# Altium project Audio_receiver.PrjPCB
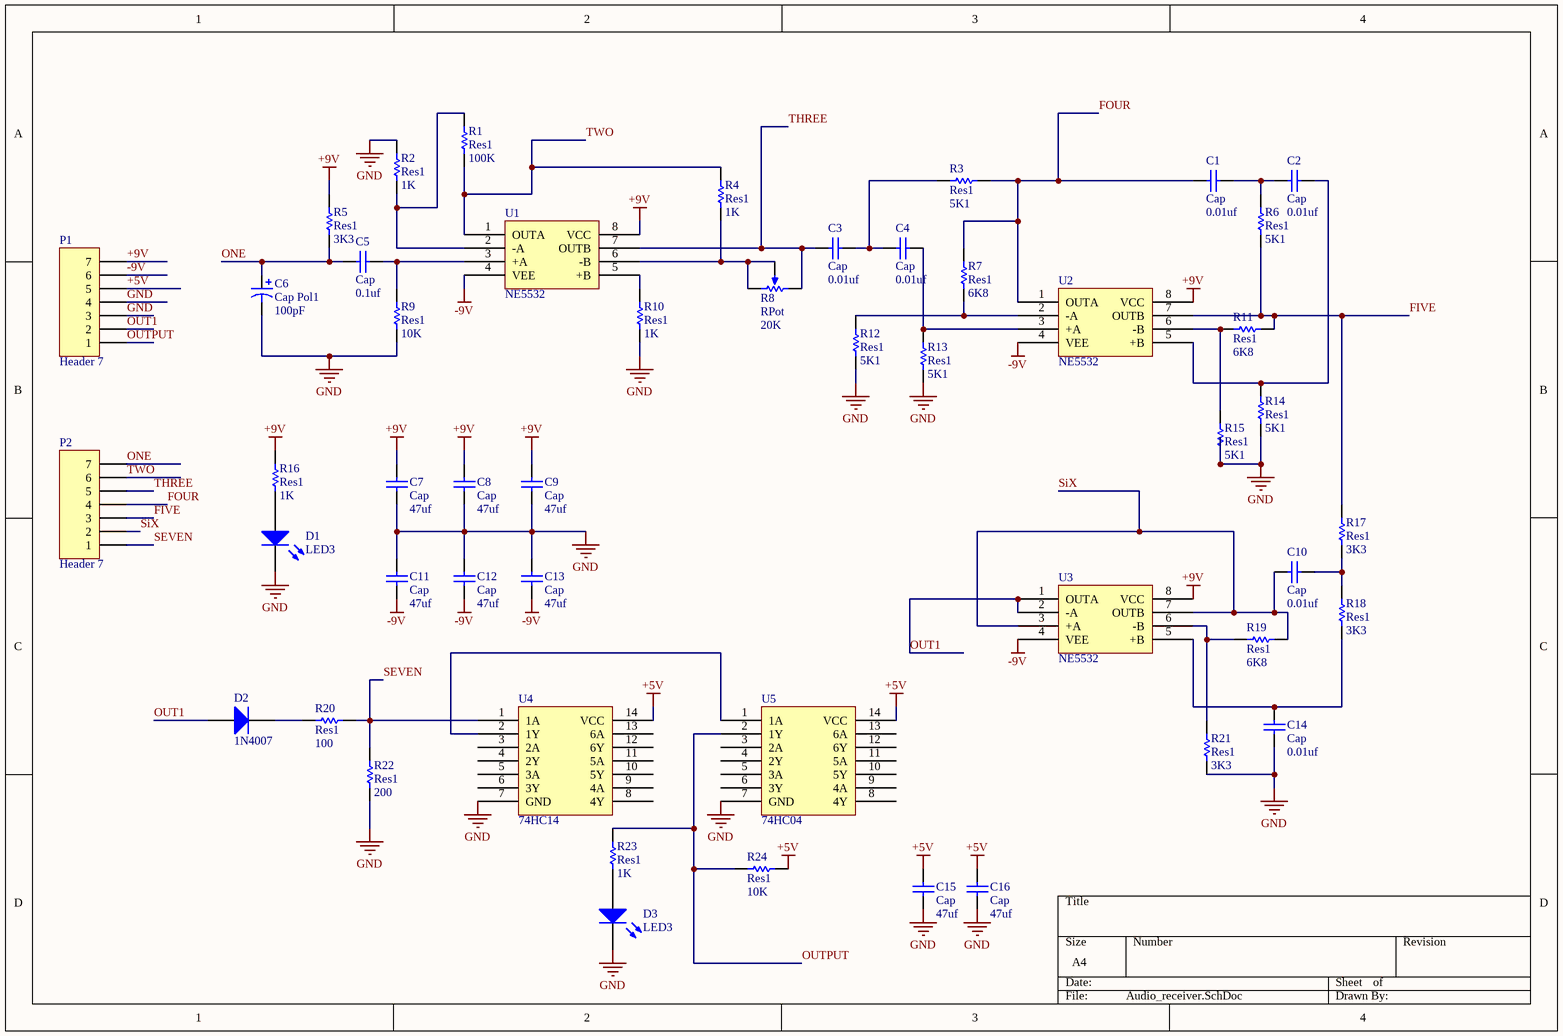
[diagram p0: Audio_receiver.SchDoc]
2 sheets, 50 parts. Net scope: global (net labels, ports and power ports of the same name join across sheets).
Board file: Audio_receiver.PcbDoc
Sheets:
  Audio_receiver.SchDoc
  Audio_creater.SchDoc

## Sheet Audio_receiver.SchDoc
size A4

### Parts
C1  Cap  value 0.01uf  [C0805]
C2  Cap  value 0.01uf  [C0805]
C3  Cap  value 0.01uf  [C0805]
C4  Cap  value 0.01uf  [C0805]
C5  Cap  value 0.1uf  [C0805]
C6  Cap Pol1  value 100pF  [CAPR5-4X5]
C7  Cap  value 47uf  [CAPR5-4X5]
C8  Cap  value 47uf  [CAPR5-4X5]
C9  Cap  value 47uf  [CAPR5-4X5]
C10  Cap  value 0.01uf  [C0805]
C11  Cap  value 47uf  [CAPR5-4X5]
C12  Cap  value 47uf  [CAPR5-4X5]
C13  Cap  value 47uf  [CAPR5-4X5]
C14  Cap  value 0.01uf  [C0805]
C15  Cap  value 47uf  [CAPR5-4X5]
C16  Cap  value 47uf  [CAPR5-4X5]
D1  LED3  [3.5X2.8X1.9]
D2  1N4007  [DO-35A]
D3  LED3  [3.5X2.8X1.9]
P1  Header 7  [HDR1X7]
P2  Header 7  [HDR1X7]
R1  Res1  value 100K  [6-0805_L]
R2  Res1  value 1K  [6-0805_L]
R3  Res1  value 5K1  [6-0805_L]
R4  Res1  value 1K  [6-0805_L]
R5  Res1  value 3K3  [6-0805_L]
R6  Res1  value 5K1  [6-0805_L]
R7  Res1  value 6K8  [6-0805_L]
R8  RPot  value 20K  [VR5]
R9  Res1  value 10K  [6-0805_L]
R10  Res1  value 1K  [6-0805_L]
R11  Res1  value 6K8  [6-0805_L]
R12  Res1  value 5K1  [6-0805_L]
R13  Res1  value 5K1  [6-0805_L]
R14  Res1  value 5K1  [6-0805_L]
R15  Res1  value 5K1  [6-0805_L]
R16  Res1  value 1K  [6-0805_N]
R17  Res1  value 3K3  [6-0805_L]
R18  Res1  value 3K3  [6-0805_L]
R19  Res1  value 6K8  [6-0805_L]
R20  Res1  value 100  [6-0805_L]
R21  Res1  value 3K3  [6-0805_L]
R22  Res1  value 200  [6-0805_L]
R23  Res1  value 1K  [6-0805_L]
R24  Res1  value 10K  [6-0805_L]
U1  NE5532  [DIP-8]
U2  NE5532  [DIP-8]
U3  NE5532  [DIP-8]
U4  74HC14  [DIP-14]
U5  74HC04  [DIP-14]

### Nets
+5V: C15.2 C16.2 P1.5 R24.1 U4.14(VCC) U5.14(VCC)
+9V: C7.2 C8.2 C9.2 P1.7 R5.2 R16.2 U1.8(VCC) U2.8(VCC) U3.8(VCC)
-9V: C11.1 C12.1 C13.1 P1.6 U1.4(VEE) U2.4(VEE) U3.4(VEE)
GND: C6.2 C7.1 C8.1 C9.1 C11.2 C12.2 C13.2 C14.1 C15.1 C16.1 D1.2(K) D3.2(K) P1.3 P1.4 R2.2 R9.1 R10.1 R12.2 R13.2 R14.2 R15.2 R21.1 R22.2 U4.7(GND) U5.7(GND)
FIVE: P2.3 R6.2 R11.2 R17.2 U2.7(OUTB)
FOUR: C1.1 P2.4 R3.1 R7.1 U2.1(OUTA)
ONE: C5.1 C6.1 P2.7 R5.1
OUT1: D2.1(A) P1.2 U3.1(OUTA) U3.2(-A)
OUTPUT: P1.1 R23.2 R24.2 U5.2(1Y)
SEVEN: P2.1 R20.1 R22.1 U4.1(1A)
SiX: C10.2 P2.2 R19.1 U3.3(+A) U3.7(OUTB)
THREE: C3.1 P2.5 R8.1(TOP) U1.7(OUTB)
TWO: P2.6 R1.1 R4.2 U1.1(OUTA)
NetC1_2: C1.2 C2.1 R6.1
NetC2_2: C2.2 R14.1 U2.5(+B)
NetC3_2: C3.2 C4.1 R3.2
NetC4_2: C4.2 R13.1 U2.3(+A)
NetC5_2: C5.2 R9.2 U1.3(+A)
NetC10_1: C10.1 R17.1 R18.2
NetC14_2: C14.2 R18.1 U3.5(+B)
NetD1_1: D1.1(A) R16.1
NetD2_2: D2.2(K) R20.2
NetD3_1: D3.1(A) R23.1
NetR1_2: R1.2 R2.1 U1.2(-A)
NetR4_1: R4.1 R8.2(BOT) R8.3(TAP) U1.6(-B)
NetR7_2: R7.2 R12.1 U2.2(-A)
NetR10_2: R10.2 U1.5(+B)
NetR11_1: R11.1 R15.1 U2.6(-B)
NetR19_2: R19.2 R21.2 U3.6(-B)
NetU4_2: U4.2(1Y) U5.1(1A)

Not connected (* = marked no-connect by the designer): U4 3(2A) 4(2Y) 5(3A) 6(3Y) 8(4Y) 9(4A) 10(5Y) 11(5A) 12(6Y) 13(6A); U5 3(2A) 4(2Y) 5(3A) 6(3Y) 8(4Y) 9(4A) 10(5Y) 11(5A) 12(6Y) 13(6A)

### Library data of the parts
C1-C5 C7-C16 = Cap: Capacitor; Published: 8-Jun-2000; LatestRevisionDate: 17-Jul-2002; LatestRevisionNote: Re-released for DXP Platform.; PackageReference: RAD-0.3; Publisher: Altium Limited; PackageDescription: Radial Cap, Thru-Hole; 2 Leads; 0.3 in Pin Spacing
C6 = Cap Pol1: Polarized Capacitor (Radial); Published: 8-Jun-2000; LatestRevisionDate: 17-Jul-2002; LatestRevisionNote: Re-released for DXP Platform.; PackageReference: RB7.6-15; Publisher: Altium Limited; PackageDescription: Polarized Capacitor (Radial); 2 Leads
D1 D3 = LED3: Typical BLUE SiC LED; Published: 8-Jun-2000; LatestRevisionDate: 17-Dec-2003; LatestRevisionNote: PCB Footprint replaced.; DatasheetVersion: 16-Apr-2002; PackageVersion: 16-Apr-2002; PackageReference: 3.5X2.8X1.9; Publisher: Altium Limited; PackageDescription: SM LED; 2 C-Bend Leads; Body 3.5 x 2.8 x 1.9 mm, inc leads (LxWxH typ)
D2 = Diode: Default Diode; Published: 8-Jun-2000; LatestRevisionDate: 17-Jul-2002; LatestRevisionNote: Re-released for DXP Platform.; PackageVersion: Sep-1996; PackageReference: SMC; Publisher: Altium Limited; PackageDescription: DO-214-AB/SMC; 2 C-Bend Leads; Body 7.9 x 5.9 mm, inc. leads (LxW); Code_JEDEC: DO-214-AB
P1 P2 = Header 7: Header, 7-Pin; LatestRevisionDate: 17-Jul-2002; LatestRevisionNote: Re-released for DXP Platform.; Publisher: Altium Limited
R1-R7 R9-R24 = Res1: Resistor; Published: 8-Jun-2000; LatestRevisionDate: 17-Jul-2002; LatestRevisionNote: Re-released for DXP Platform.; PackageReference: AXIAL-0.3; Publisher: Altium Limited; PackageDescription: Axial Device, Thru-Hole; 2 Leads; 0.3 in Pin Spacing
R8 = RPot: Potentiometer; Sim Note: Enter the Resistance value and the set point into parameter fields.; Set Position: 0.5; Published: 8-Jun-2000; LatestRevisionDate: 17-Jul-2002; LatestRevisionNote: Re-released for DXP Platform.; PackageReference: VR5; Publisher: Altium Limited; PackageDescription: Variable Resistor, Thru-Hole; 3 Leads

## Sheet Audio_creater.SchDoc
size A4